# Altium schematic sheet Analog Output.SchDoc: Analog Output
size A4; SheetNumber: 6; SheetTotal: 5
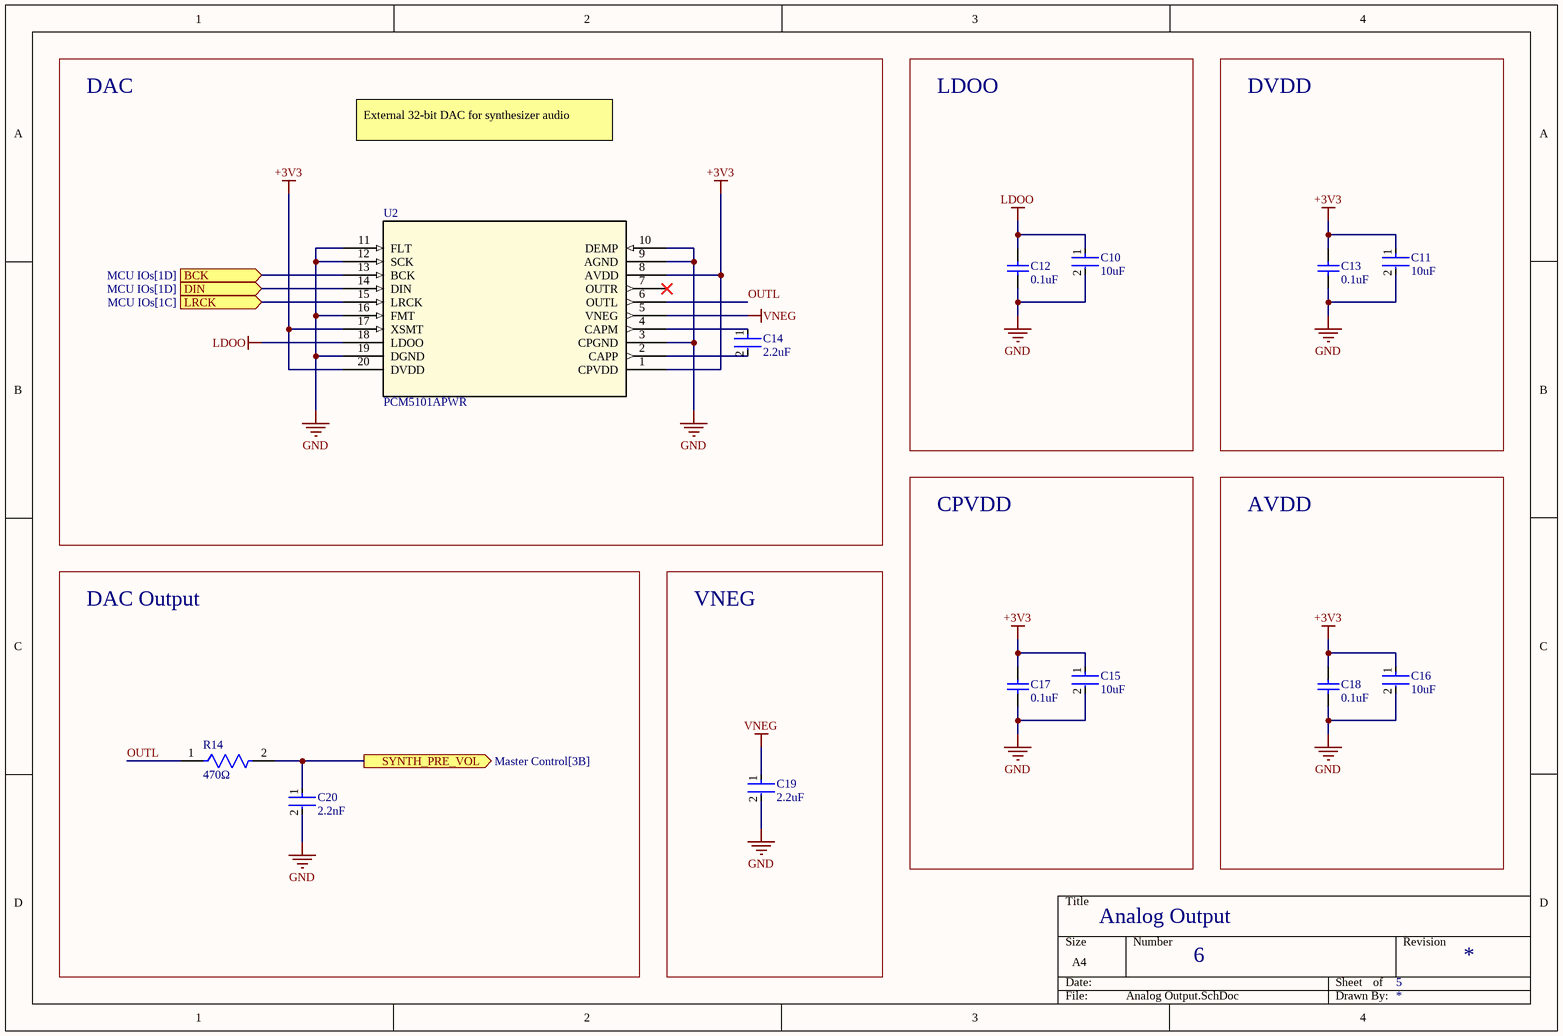
[diagram p0: Analog Output.SchDoc]

## Parts
C10  10uF  [FP-GRM188-0_2-IPC_A]
C11  10uF  [FP-GRM188-0_2-IPC_A]
C12  0.1uF  [CAPC1608X92X38LL15T08]
C13  0.1uF  [CAPC1608X92X38LL15T08]
C14  2.2uF  [FP-CC0603-DA-MFG]
C15  10uF  [FP-GRM188-0_2-IPC_A]
C16  10uF  [FP-GRM188-0_2-IPC_A]
C17  0.1uF  [CAPC1608X92X38LL15T08]
C18  0.1uF  [CAPC1608X92X38LL15T08]
C19  2.2uF  [FP-CC0603-DA-MFG]
C20  2.2nF  [FP-C0603C-CF-MFG]
R14  470Ω  [FP-RT0603-MFG]
U2  PCM5101APWR  [PW20]

## Blocks framed on the sheet
DAC: C14 U2
LDOO: C10 C12
DVDD: C11 C13
CPVDD: C15 C17
AVDD: C16 C18
DAC Output: C20 R14
VNEG: C19

## Ports
BCK (in, see MCU IOs[1D]), DIN (in, see MCU IOs[1D]), LRCK (in, see MCU IOs[1C]), SYNTH_PRE_VOL (out, see Master Control[3B])

## Nets
+3V3: C11.1 C13.2 C15.1 C16.1 C17.2 C18.2 U2.1(CPVDD) U2.8(AVDD) U2.17(XSMT) U2.20(DVDD)
GND: C10.2 C11.2 C12.1 C13.1 C15.2 C16.2 C17.1 C18.1 C19.2 C20.2 U2.3(CPGND) U2.9(AGND) U2.10(DEMP) U2.11(FLT) U2.12(SCK) U2.16(FMT) U2.19(DGND)
LDOO: C10.1 C12.2 U2.18(LDOO)
VNEG: C19.1 U2.5(VNEG)
BCK: U2.13(BCK) ; port BCK
DIN: U2.14(DIN) ; port DIN
LRCK: U2.15(LRCK) ; port LRCK
OUTL: R14.1 U2.6(OUTL)
SYNTH_PRE_VOL: C20.1 R14.2 ; port SYNTH_PRE_VOL
NetC14_1: C14.1 U2.4(CAPM)
NetC14_2: C14.2 U2.2(CAPP)

Not connected (* = marked no-connect by the designer): U2 7(OUTR)*

## Notes on the sheet
- External 32-bit DAC for synthesizer audio

## Library data of the parts
C10 C11 C15 C16 = CMP-06035-045268-1: Chip Multilayer Ceramic Capacitors for General Purpose, 0603, 10uF, X5R, 15%, 10%, 25V; Case/Package: 0603
C12 C13 C17 C18 = CMP-2006-00951-1: Manufacturer: Vishay; Part Number: VJ0603Y104KXJAR
C14 C19 = CMP-03422-001238-1: CAP CER 2.2UF 16V X7R 0603; Manufacturer: YAGEO; Manufacturer Part Number: CC0603KRX7R7BB225; Temperature Coefficient: 15%; Material: Ceramic; Tolerance: 0.1; Voltage: 16 V; Temperature Range High: +125°C; Digikey Description: CAP CER 2.2UF 16V X7R 0603; Temperature: -55°C to +125°C; Value: 2.2 uF; Lead Free: Yes; Capacitance: 2.2 uF; Package: CC0603-DA; ComponentLink2URL: http://www.yageo.com/documents/recent/UPY-GPHC_X7R_6.3V-to-50V_18.pdf; Device Class L1: Passive Components; Category: Cap; ComponentLink2Description: Datasheet; Mouser Description: Cap Ceramic 2.2uF 16V X7R 10% Pad SMD 0603 125C Automotive T/R; Device Class L2: Capacitors; RoHS: TRUE; Automotive: No; Voltage Rating: 16 V; Device Class L3: Ceramic Capacitors; Temperature Range Low: -55°C; Height: 0.9mm; Footprint Url: http://www.yageo.com/exep/pages/download/literatures/UPY-C_GEN_24.pdf; Temperature Characteristic: X7R; Octopart: https://octopart.com/cc0603krx7r7bb225-yageo-67146440
C20 = CMP-03020-015097-1: C0603 2,200 pF C0G 30ppm/°C 1.00% 200 V; Manufacturer: KEMET; Manufacturer Part Number: C0603C222F2GAC7411; Tolerance: 0.01; Automotive Grade: Grade 1; Material: Ceramic; Voltage Rating: 200 V; Temperature Range Low: -55°C; Temperature: -55°C to +125°C; ComponentLink2Description: Datasheet; ComponentLink2URL: https://api.kemet.com/component-edge/download/datasheet/C0603C100J5GACAUTO.pdf; Device Class L3: Ceramic Capacitors; Temperature Coefficient: 30ppm/°C; Device Class L1: Passive Components; Height: 0.87mm; Temperature Range High: +125°C; Category: Cap; Device Class L2: Capacitors; Package: C0603C-CF; RoHS: TRUE; Temperature Characteristic: C0G; Value: 2,200 pF; Automotive: Yes; Mouser Description: Multilayer Ceramic Capacitors MLCC - SMD/SMT 200volts 2.2nF 1% C0G; Lead Free: Yes; Octopart: https://octopart.com/c0603c222f2gac7411-kemet-104967403; Capacitance: 2,200 pF
R14 = CMP-03412-030448-1: RES SMD 470 OHM 0.25% 1/10W 0603; Manufacturer: Yageo; Manufacturer Part Number: RT0603CRE07470RL; Temperature Coefficient: 50 ppm/°C; Tolerance: 0.0025; Power Rating: 0.1W; Voltage Rating: 75V; Ipc Land Pattern Name: RESC16080X45; Device Class L2: Resistors; Resistance: 470Ω; Temperature Range Low: -55°C; Composition: Thin Film; Category: Res; Footprint Url: http://www.yageo.com/exep/pages/download/literatures/PYu-R_Mount_10.pdf; Lead Free: Yes; Digikey Description: RES SMD 470 OHM 0.25% 1/10W 0603; Package: RT0603; ComponentLink2Description: Datasheet; Octopart: https://octopart.com/rt0603cre07470rl-yageo-1250070; Height: 0.55mm; RoHS: TRUE; Temperature Range High: +155°C; Series: RT; Temperature: -55°C to +155°C; Device Class L1: Passive Components; Value: 470Ω; Automotive: No; Device Class L3: Chip SMD Resistors; ComponentLink2URL: http://www.yageo.com/documents/recent/PYu-RT_1-to-0.01_RoHS_L_9.pdf
U2 = PCM5101APWR: 2VRMS DirectPath&trade;, 106dB Audio Stereo DAC with 32-bit, 384kHz PCM Interface 20-TSSOP -25 to 85; Manufacturer_Name: Texas Instruments; Copyright: Copyright (C) 2025 Ultra Librarian. All rights reserved.; Manufacturer_Part_Number: PCM5101APWR; RefDes: RefDes; Type: Type